# Altium project 生日礼物V2.PrjPcb
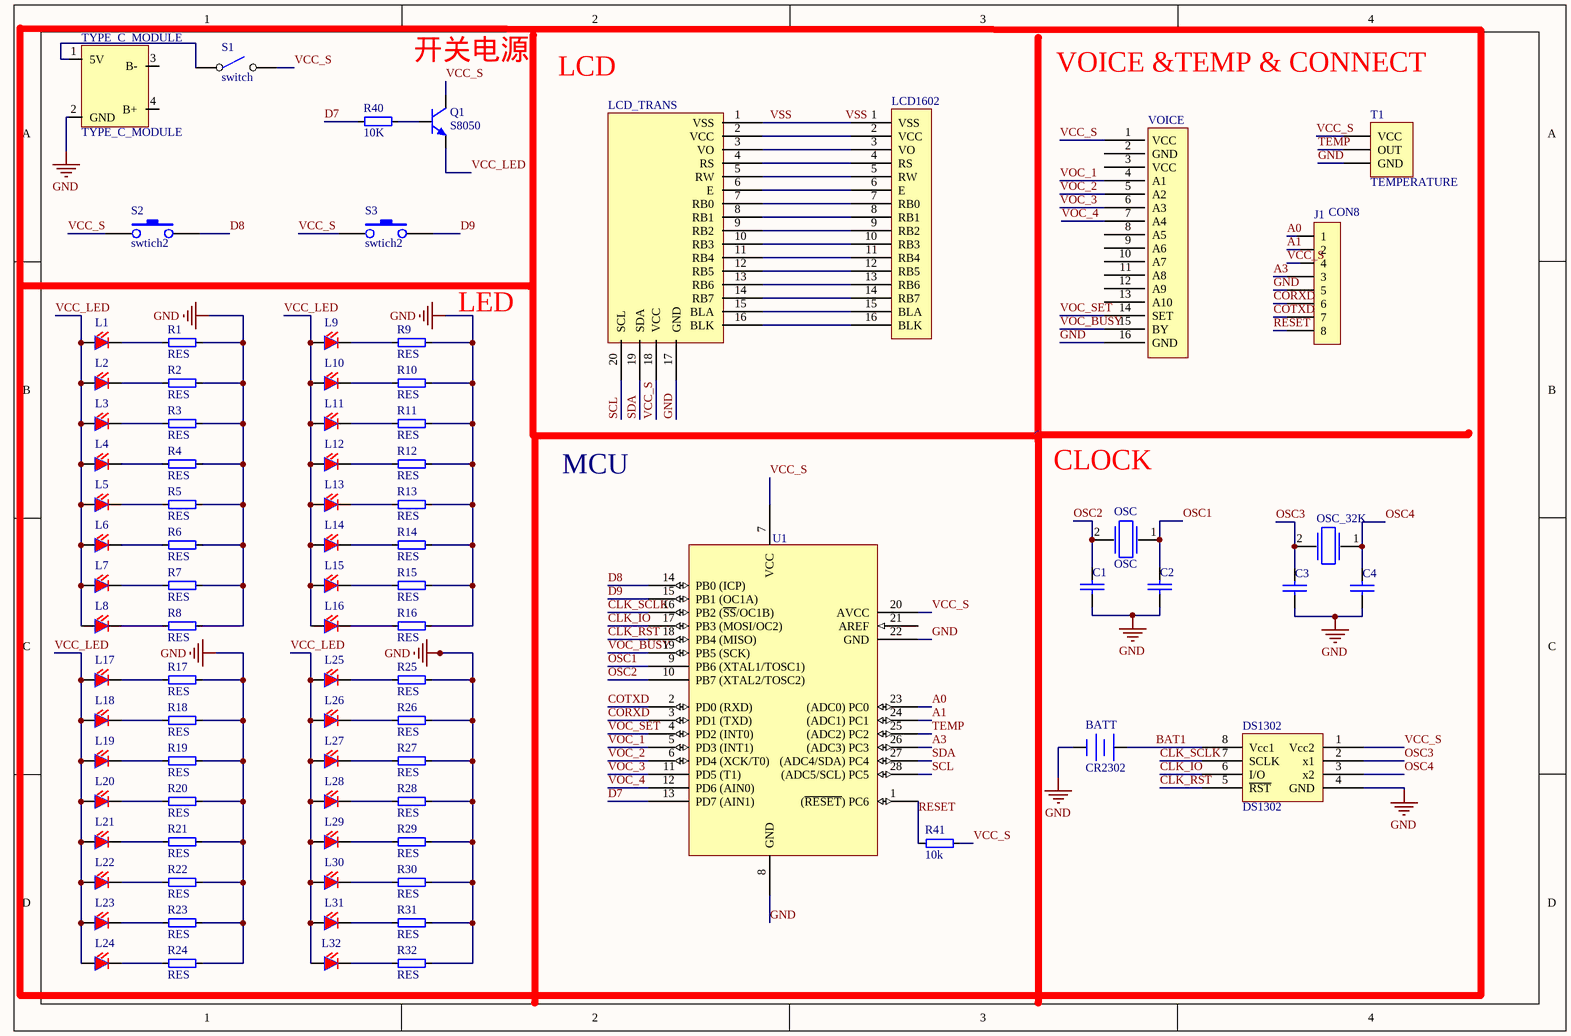
[diagram p0: 生日礼物V2.SchDoc]
1 sheet, 85 parts. Net scope: global (net labels, ports and power ports of the same name join across sheets).
Board file: 生日礼物V2.PcbDoc

## Sheet 生日礼物V2.SchDoc
size A4; SheetNumber: 1; SheetTotal: 1

### Parts
BATT  CR2302  [CR2032_C]
C1  (no value)  [CAP]
C2  (no value)  [CAP]
C3  (no value)  [CAP]
C4  (no value)  [CAP]
DS1302  DS1302  [DS1302]
J1  CON8  [CON8]
L1  (no value)  [LED 5MM-Y]
L2  (no value)  [LED 5MM-Y]
L3  (no value)  [LED 5MM-Y]
L4  (no value)  [LED 5MM-Y]
L5  (no value)  [LED 5MM-Y]
L6  (no value)  [LED 5MM-Y]
L7  (no value)  [LED 5MM-Y]
L8  (no value)  [LED 5MM-Y]
L9  (no value)  [LED 5MM-Y]
L10  (no value)  [LED 5MM-Y]
L11  (no value)  [LED 5MM-Y]
L12  (no value)  [LED 5MM-Y]
L13  (no value)  [LED 5MM-Y]
L14  (no value)  [LED 5MM-Y]
L15  (no value)  [LED 5MM-Y]
L16  (no value)  [LED 5MM-Y]
L17  (no value)  [LED 5MM-Y]
L18  (no value)  [LED 5MM-Y]
L19  (no value)  [LED 5MM-Y]
L20  (no value)  [LED 5MM-Y]
L21  (no value)  [LED 5MM-Y]
L22  (no value)  [LED 5MM-Y]
L23  (no value)  [LED 5MM-Y]
L24  (no value)  [LED 5MM-Y]
L25  (no value)  [LED 5MM-Y]
L26  (no value)  [LED 5MM-Y]
L27  (no value)  [LED 5MM-Y]
L28  (no value)  [LED 5MM-Y]
L29  (no value)  [LED 5MM-Y]
L30  (no value)  [LED 5MM-Y]
L31  (no value)  [LED 5MM-Y]
L32  (no value)  [LED 5MM-Y]
LCD1602  (no value)  [LCD1602]
LCD_TRANS  (no value)  [LCD-TRANS]
OSC  OSC  [OSC HC-49U]
OSC_32K  (no value)  [osc_32.768K]
Q1  S8050  [TO92]
R1  RES  [0805R]
R2  RES  [0805R]
R3  RES  [0805R]
R4  RES  [0805R]
R5  RES  [0805R]
R6  RES  [0805R]
R7  RES  [0805R]
R8  RES  [0805R]
R9  RES  [0805R]
R10  RES  [0805R]
R11  RES  [0805R]
R12  RES  [0805R]
R13  RES  [0805R]
R14  RES  [0805R]
R15  RES  [0805R]
R16  RES  [0805R]
R17  RES  [0805R]
R18  RES  [0805R]
R19  RES  [0805R]
R20  RES  [0805R]
R21  RES  [0805R]
R22  RES  [0805R]
R23  RES  [0805R]
R24  RES  [0805R]
R25  RES  [0805R]
R26  RES  [0805R]
R27  RES  [0805R]
R28  RES  [0805R]
R29  RES  [0805R]
R30  RES  [0805R]
R31  RES  [0805R]
R32  RES  [0805R]
R40  10K  [0805R]
R41  10k  [0805R]
S1  switch  [switch]
S2  swtich2  [switch]
S3  swtich2  [switch]
T1  TEMPERATURE  [TEMP_SENSOR]
TYPE_C_MODULE  TYPE_C_MODULE  [TYPE_C_Module]
U1  (no value)  [DIP28]
VOICE  (no value)  [VOICE]

### Nets
GND: BATT.2(-) C1.2 C2.2 C3.2 C4.2 DS1302.4(GND) J1.5 LCD_TRANS.17(GND) R1.2 R2.2 R3.2 R4.2 R5.2 R6.2 R7.2 R8.2 R9.2 R10.2 R11.2 R12.2 R13.2 R14.2 R15.2 R16.2 R17.2 R18.2 R19.2 R20.2 R21.2 R22.2 R23.2 R24.2 R25.2 R26.2 R27.2 R28.2 R29.2 R30.2 R31.2 R32.2 T1.3(GND) TYPE_C_MODULE.2(GND) U1.8(GND) U1.22(GND) VOICE.16(GND)
A0: J1.1 U1.23((ADC0)_PC0)
A1: J1.2 U1.24((ADC1)_PC1)
A3: J1.3 U1.26((ADC3)_PC3)
BAT1: BATT.1(+) DS1302.8(Vcc1)
CLK_IO: DS1302.6(I/O) U1.17(PB3_(MOSI/OC2))
CLK_RST: DS1302.5(~{RST}) U1.18(PB4_(MISO))
CLK_SCLK: DS1302.7(SCLK) U1.16(PB2_(~{SS}/OC1B))
CORXD: J1.6 U1.3(PD1_(TXD))
COTXD: J1.7 U1.2(PD0_(RXD))
D7: R40.1 U1.13(PD7_(AIN1))
D8: S2.2 U1.14(PB0_(ICP))
D9: S3.2 U1.15(PB1_(OC1A))
OSC1: C2.1 OSC.1 U1.9(PB6_(XTAL1/TOSC1))
OSC2: C1.1 OSC.2 U1.10(PB7_(XTAL2/TOSC2))
OSC3: C3.1 DS1302.2(x1) OSC_32K.2
OSC4: C4.1 DS1302.3(x2) OSC_32K.1
RESET: J1.8 R41.1 U1.1((~{RESET})_PC6)
SCL: LCD_TRANS.20(SCL) U1.28((ADC5/SCL)_PC5)
SDA: LCD_TRANS.19(SDA) U1.27((ADC4/SDA)_PC4)
TEMP: T1.2(OUT) U1.25((ADC2)_PC2)
VCC_LED: L1.1(A) L2.1(A) L3.1(A) L4.1(A) L5.1(A) L6.1(A) L7.1(A) L8.1(A) L9.1(A) L10.1(A) L11.1(A) L12.1(A) L13.1(A) L14.1(A) L15.1(A) L16.1(A) L17.1(A) L18.1(A) L19.1(A) L20.1(A) L21.1(A) L22.1(A) L23.1(A) L24.1(A) L25.1(A) L26.1(A) L27.1(A) L28.1(A) L29.1(A) L30.1(A) L31.1(A) L32.1(A) Q1.1(E)
VCC_S: DS1302.1(Vcc2) J1.4 LCD_TRANS.18(VCC) Q1.3(C) R41.2 S1.2 S2.1 S3.1 T1.1(VCC) U1.7(VCC) U1.20(AVCC) VOICE.1(VCC)
VOC_1: U1.5(PD3_(INT1)) VOICE.4(A1)
VOC_2: U1.6(PD4_(XCK/T0)) VOICE.5(A2)
VOC_3: U1.11(PD5_(T1)) VOICE.6(A3)
VOC_4: U1.12(PD6_(AIN0)) VOICE.7(A4)
VOC_BUSY: U1.19(PB5_(SCK)) VOICE.15(BY)
VOC_SET: U1.4(PD2_(INT0)) VOICE.14(SET)
VSS: LCD1602.1(VSS) LCD_TRANS.1(VSS)
NetL1_2: L1.2(K) R1.1
NetL2_2: L2.2(K) R2.1
NetL3_2: L3.2(K) R3.1
NetL4_2: L4.2(K) R4.1
NetL5_2: L5.2(K) R5.1
NetL6_2: L6.2(K) R6.1
NetL7_2: L7.2(K) R7.1
NetL8_2: L8.2(K) R8.1
NetL9_2: L9.2(K) R9.1
NetL10_2: L10.2(K) R10.1
NetL11_2: L11.2(K) R11.1
NetL12_2: L12.2(K) R12.1
NetL13_2: L13.2(K) R13.1
NetL14_2: L14.2(K) R14.1
NetL15_2: L15.2(K) R15.1
NetL16_2: L16.2(K) R16.1
NetL17_2: L17.2(K) R17.1
NetL18_2: L18.2(K) R18.1
NetL19_2: L19.2(K) R19.1
NetL20_2: L20.2(K) R20.1
NetL21_2: L21.2(K) R21.1
NetL22_2: L22.2(K) R22.1
NetL23_2: L23.2(K) R23.1
NetL24_2: L24.2(K) R24.1
NetL25_2: L25.2(K) R25.1
NetL26_2: L26.2(K) R26.1
NetL27_2: L27.2(K) R27.1
NetL28_2: L28.2(K) R28.1
NetL29_2: L29.2(K) R29.1
NetL30_2: L30.2(K) R30.1
NetL31_2: L31.2(K) R31.1
NetL32_2: L32.2(K) R32.1
NetLCD1602_2: LCD1602.2(VCC) LCD_TRANS.2(VCC)
NetLCD1602_3: LCD1602.3(VO) LCD_TRANS.3(VO)
NetLCD1602_4: LCD1602.4(RS) LCD_TRANS.4(RS)
NetLCD1602_5: LCD1602.5(RW) LCD_TRANS.5(RW)
NetLCD1602_6: LCD1602.6(E) LCD_TRANS.6(E)
NetLCD1602_7: LCD1602.7(RB0) LCD_TRANS.7(RB0)
NetLCD1602_8: LCD1602.8(RB1) LCD_TRANS.8(RB1)
NetLCD1602_9: LCD1602.9(RB2) LCD_TRANS.9(RB2)
NetLCD1602_10: LCD1602.10(RB3) LCD_TRANS.10(RB3)
NetLCD1602_11: LCD1602.11(RB4) LCD_TRANS.11(RB4)
NetLCD1602_12: LCD1602.12(RB5) LCD_TRANS.12(RB5)
NetLCD1602_13: LCD1602.13(RB6) LCD_TRANS.13(RB6)
NetLCD1602_14: LCD1602.14(RB7) LCD_TRANS.14(RB7)
NetLCD1602_15: LCD1602.15(BLA) LCD_TRANS.15(BLA)
NetLCD1602_16: LCD1602.16(BLK) LCD_TRANS.16(BLK)
NetQ1_2: Q1.2(B) R40.2
NetS1_1: S1.1 TYPE_C_MODULE.1(5V)

Not connected (* = marked no-connect by the designer): TYPE_C_MODULE 3(B-) 4(B+); U1 21(AREF); VOICE 2(GND) 3(VCC) 8(A5) 9(A6) 10(A7) 11(A8) 12(A9) 13(A10)

### Notes on the sheet
- 开关电源
- (near LCD_TRANS) LCD
- VOICE &TEMP & CONNECT
- (near R9) LED
- MCU
- CLOCK

### Library data of the parts
BATT = BATTERY: Multicell Battery; Published: 24-Mar-1999; LatestRevisionDate: 17-Jul-2002; LatestRevisionNote: Re-released for DXP Platform.; PackageReference: BAT-2; Publisher: Altium Limited
C1-C4 = CAP
L1-L32 = LED
LCD1602 = LCD1602
LCD_TRANS = LCD_TRANS
OSC = OSC: 晶振 32.768KHZ
OSC_32K = OSC_32K
Q1 = 8050-DIP: 高频放大-NPN型; 版权归属: 源创客; 属性: 40V 1.5A 1W 100MHZ; BOM名称: 高频放大-NPN型; 学习资源: www.ooocke.com
R40 R41 = RES
S1 = switch: 主开关
S2 = swtich: 按钮触发
S3 = swtich
T1 = TEMPERATURE: 温度传感器
U1 = ATMEGA8_DIP28: Atmel Microcontroller - Library created by carel..  <www.mpfreezone.com>
VOICE = VOICE